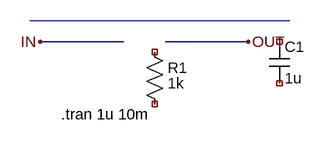
[diagram p0: schematic sample_ltspice.asc]
sample_ltspice.asc, the LTspice schematic file:
Version 4
SHEET 1 880 680
WIRE 128 128 256 128
WIRE 320 128 448 128
FLAG 128 128 IN
FLAG 448 128 OUT
SYMBOL res 288 128 R0
WINDOW 3 36 64 Left 2
SYMATTR InstName R1
SYMATTR Value 1k
SYMBOL cap 480 128 R0
SYMATTR InstName C1
SYMATTR Value 1u
TEXT 160 240 Left 2 !.tran 1u 10m
LINE Normal 112 96 512 96

The netlist it stands for:
* sample_ltspice.asc
R1 NC_01 NC_02 1k
C1 NC_03 NC_04 1u
.tran 1u 10m
.backanno
.end